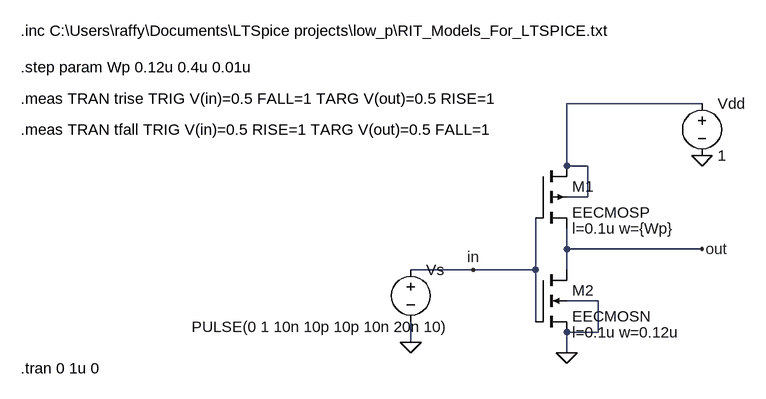
[diagram p0: schematic Draft1.asc]
Draft1.asc, the LTspice schematic file:
Version 4
SHEET 1 880 680
WIRE -176 144 -384 144
WIRE -384 240 -384 144
WIRE -352 240 -384 240
WIRE -352 288 -352 240
WIRE -352 288 -384 288
WIRE -384 368 -384 336
WIRE -176 368 -384 368
WIRE -528 400 -624 400
WIRE -432 400 -432 320
WIRE -432 400 -528 400
WIRE -384 400 -384 368
WIRE -336 448 -384 448
WIRE -432 480 -432 400
WIRE -336 496 -336 448
WIRE -336 496 -384 496
WIRE -624 512 -624 480
WIRE -384 528 -384 496
FLAG -624 512 0
FLAG -384 528 0
FLAG -176 224 0
FLAG -176 368 out
FLAG -528 400 in
SYMBOL pmos4 -432 240 R0
WINDOW 123 56 96 Left 2
SYMATTR InstName M1
SYMATTR Value EECMOSP
SYMATTR Value2 l=0.1u w={Wp}
SYMBOL nmos4 -432 400 R0
WINDOW 123 56 96 Left 2
SYMATTR InstName M2
SYMATTR Value EECMOSN
SYMATTR Value2 l=0.1u w=0.12u
SYMBOL voltage -176 128 R0
SYMATTR InstName Vdd
SYMATTR Value 1
SYMBOL voltage -624 384 R0
WINDOW 3 -337 104 Left 2
WINDOW 123 0 0 Left 0
WINDOW 39 0 0 Left 0
SYMATTR InstName Vs
SYMATTR Value PULSE(0 1 10n 10p 10p 10n 20n 10)
TEXT -1224 32 Left 2 !.inc C:\\Users\\raffy\\Documents\\LTSpice projects\\low_p\\RIT_Models_For_LTSPICE.txt
TEXT -1224 88 Left 2 !.step param Wp 0.12u 0.4u 0.01u
TEXT -1224 136 Left 2 !.meas TRAN trise TRIG V(in)=0.5 FALL=1 TARG V(out)=0.5 RISE=1
TEXT -1224 184 Left 2 !.meas TRAN tfall TRIG V(in)=0.5 RISE=1 TARG V(out)=0.5 FALL=1
TEXT -1224 552 Left 2 !.tran 0 1u 0

The netlist it stands for:
* Draft1.asc
M1 N001 in out N001 EECMOSP l=0.1u w={Wp}
M2 out in 0 0 EECMOSN l=0.1u w=0.12u
Vdd N001 0 1
Vs in 0 PULSE(0 1 10n 10p 10p 10n 20n 10)
.model NMOS NMOS
.model PMOS PMOS
.lib standard.mos
.inc C:\Users\raffy\Documents\LTSpice projects\low_p\RIT_Models_For_LTSPICE.txt
.step param Wp 0.12u 0.4u 0.01u
.meas TRAN trise TRIG V(in)=0.5 FALL=1 TARG V(out)=0.5 RISE=1
.meas TRAN tfall TRIG V(in)=0.5 RISE=1 TARG V(out)=0.5 FALL=1
.tran 0 1u 0
.backanno
.end